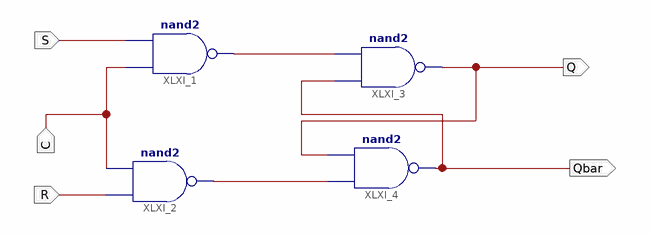
[diagram p0: schematic sheet 1]
// Xilinx ISE schematic CSR_LATCH.sch (kintex7) as structural Verilog: 4 symbols, 5 ports
module CSR_LATCH (
  input  C,
  input  S,
  input  R,
  output Q,
  output Qbar
);

  wire XLXN_1, XLXN_2;

  nand XLXI_1 (XLXN_1, C, S);
  nand XLXI_2 (XLXN_2, R, C);
  nand XLXI_3 (Q, Qbar, XLXN_1);
  nand XLXI_4 (Qbar, XLXN_2, Q);
endmodule
